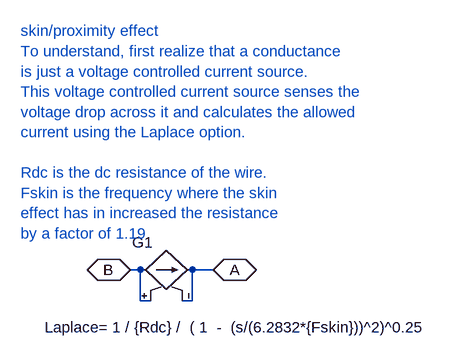
[diagram p0: schematic Skinister.asc]
Skinister.asc, the LTspice schematic file:
Version 4
SHEET 1 2904 744
WIRE 1008 -2608 992 -2608
WIRE 1008 -2560 1008 -2608
WIRE 1024 -2560 1008 -2560
WIRE 1088 -2560 1072 -2560
WIRE 1088 -2560 1088 -2608
WIRE 1120 -2608 1088 -2608
FLAG 992 -2608 B
IOPIN 992 -2608 BiDir
FLAG 1120 -2608 A
IOPIN 1120 -2608 BiDir
SYMBOL g2 1104 -2608 M270
WINDOW 0 42 76 VRight 0
WINDOW 3 -89 -347 VRight 0
SYMATTR InstName G1
SYMATTR Value Laplace= 1 / {Rdc} /  ( 1  -  (s/(6.2832*{Fskin}))^2)^0.25
TEXT 824 -2976 Left 0 ;skin/proximity effect\nTo understand, first realize that a conductance \nis just a voltage controlled current source.\nThis voltage controlled current source senses the \nvoltage drop across it and calculates the allowed \ncurrent using the Laplace option.\n \nRdc is the dc resistance of the wire.\nFskin is the frequency where the skin\neffect has in increased the resistance\nby a factor of 1.19

The netlist it stands for:
* Skinister.asc
G1 B A B A Laplace= 1 / {Rdc} /  ( 1  -  (s/(6.2832*{Fskin}))^2)^0.25
* skin/proximity effect
* To understand, first realize that a conductance
* is just a voltage controlled current source.
* This voltage controlled current source senses the
* voltage drop across it and calculates the allowed
* current using the Laplace option.
* Rdc is the dc resistance of the wire.
* Fskin is the frequency where the skin
* effect has in increased the resistance
* by a factor of 1.19
.backanno
.end